# Altium project NRF_USB.PrjPcb
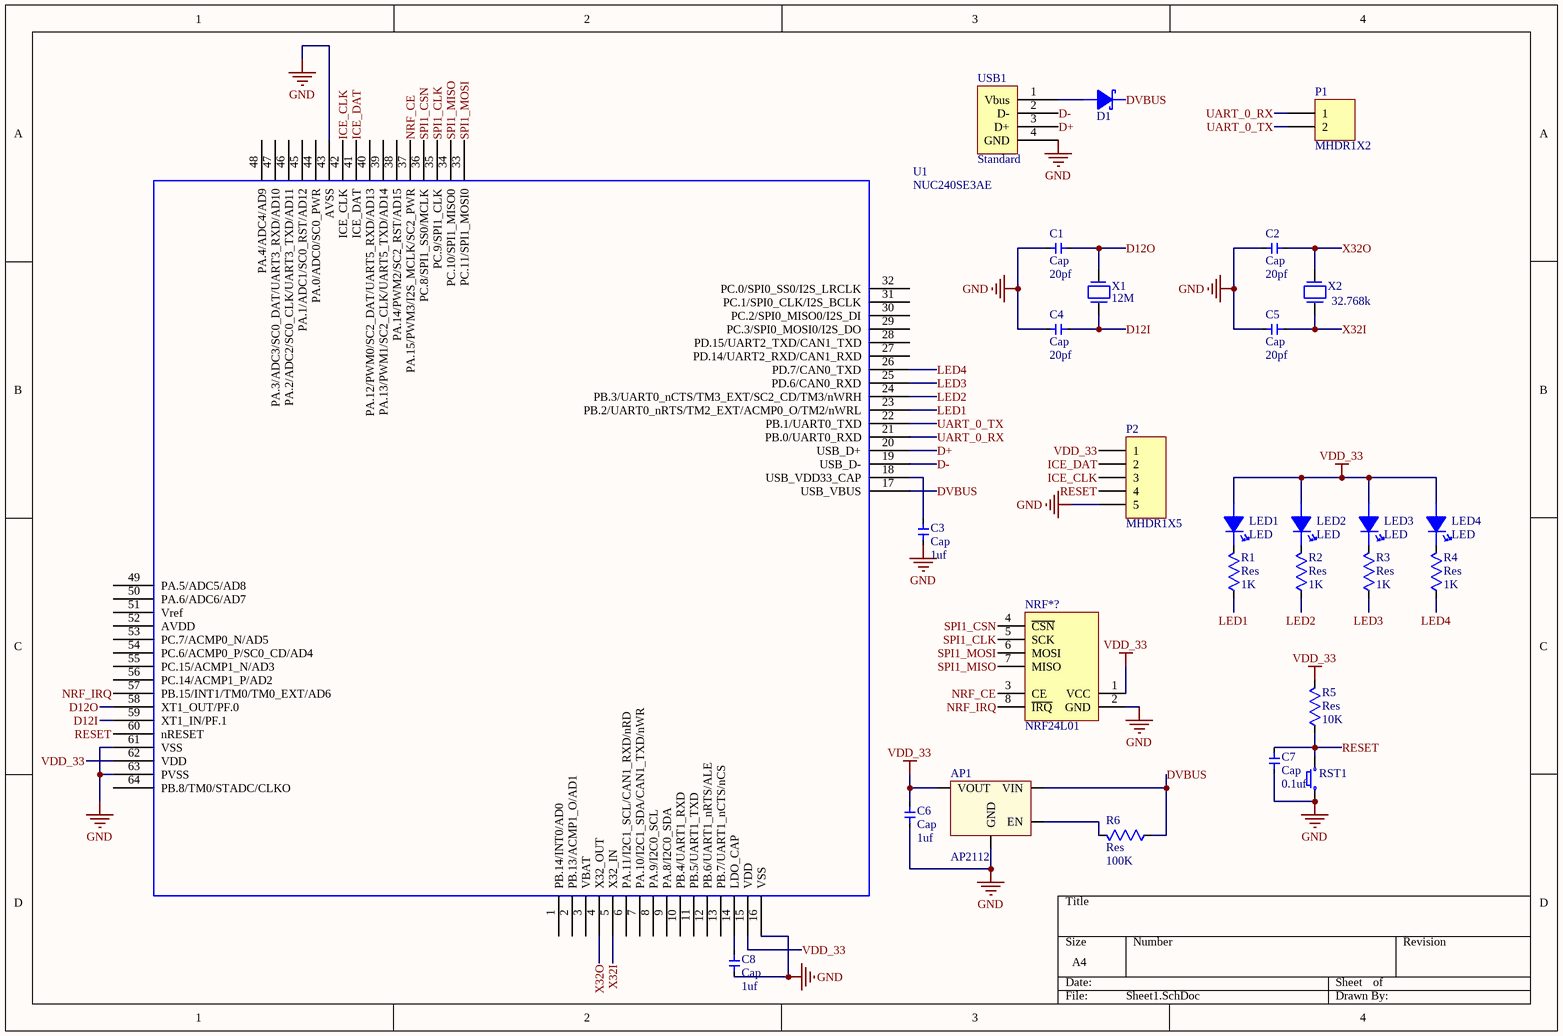
[diagram p0: Sheet1.SchDoc]
1 sheet, 28 parts. Net scope: global (net labels, ports and power ports of the same name join across sheets).
Board file: USB_NRF.PcbDoc

## Sheet Sheet1.SchDoc
size A4

### Parts
AP1  AP2112  [SOT-23-5]
C1  Cap  value 20pf  [Cap_0603]
C2  Cap  value 20pf  [Cap_0603]
C3  Cap  value 1uf  [Cap_0603]
C4  Cap  value 20pf  [Cap_0603]
C5  Cap  value 20pf  [Cap_0603]
C6  Cap  value 1uf  [Cap_0603]
C7  Cap  value 0.1uf  [Cap_0603]
C8  Cap  value 1uf  [Cap_0603]
D1  Schottky  [SOD-523]  (value not drawn)
LED1  LED  [SMD-0603_LED]
LED2  LED  [SMD-0603_LED]
LED3  LED  [SMD-0603_LED]
LED4  LED  [SMD-0603_LED]
NRF*?  NRF24L01  [NRF24L01_Module_SMD]
P1  MHDR1X2  [MHDR1X2]
P2  MHDR1X5  [MHDR1X5]
R1  Res  value 1K  [RES_0603]
R2  Res  value 1K  [RES_0603]
R3  Res  value 1K  [RES_0603]
R4  Res  value 1K  [RES_0603]
R5  Res  value 10K  [RES_0603]
R6  Res  value 100K  [RES_0603]
RST1  SPST  [TACK-SW_SMD 2P 4x3mm_2]  (value not drawn)
U1  NUC240SE3AE  [MCU_LQFP_64_7x7]
USB1  Standard  [USB_Type-A_P_Thru-Hole]
X1  value 12M  [2520S]  (hidden comment: Xtal)
X2  value 32.768k  [FC-135]  (hidden comment: Xtal)

### Nets
GND: AP1.2(GND) C1.1 C2.1 C3.2 C4.1 C5.1 C6.1 C7.1 C8.1 NRF*?.2(GND) P2.5 RST1.2 U1.16(VSS) U1.43(AVSS) U1.61(VSS) U1.63(PVSS) USB1.4(GND)
VDD_33: AP1.5(VOUT) C6.2 LED1.1 LED2.1 LED3.1 LED4.1 NRF*?.1(VCC) P2.1 R5.1 U1.15(VDD) U1.62(VDD)
D12I: C4.2 U1.59(XT1_IN/PF.1) X1.2
D12O: C1.2 U1.58(XT1_OUT/PF.0) X1.1
D+: U1.20(USB_D+) USB1.3(D+)
D-: U1.19(USB_D-) USB1.2(D-)
DVBUS: AP1.1(VIN) D1.2 R6.2 U1.17(USB_VBUS)
ICE_CLK: P2.3 U1.42(ICE_CLK)
ICE_DAT: P2.2 U1.41(ICE_DAT)
LED1: R1.2 U1.23(PB.2/UART0_nRTS/TM2_EXT/ACMP0_O/TM2/nWRL)
LED2: R2.2 U1.24(PB.3/UART0_nCTS/TM3_EXT/SC2_CD/TM3/nWRH)
LED3: R3.2 U1.25(PD.6/CAN0_RXD)
LED4: R4.2 U1.26(PD.7/CAN0_TXD)
NRF_CE: NRF*?.3(CE) U1.37(PA.15/PWM3/I2S_MCLK/SC2_PWR)
NRF_IRQ: NRF*?.8(~{IRQ}) U1.57(PB.15/INT1/TM0/TM0_EXT/AD6)
RESET: C7.2 P2.4 R5.2 RST1.1 U1.60(nRESET)
SPI1_CLK: NRF*?.5(SCK) U1.35(PC.9/SPI1_CLK)
SPI1_CSN: NRF*?.4(~{CSN}) U1.36(PC.8/SPI1_SS0/MCLK)
SPI1_MISO: NRF*?.7(MISO) U1.34(PC.10/SPI1_MISO0)
SPI1_MOSI: NRF*?.6(MOSI) U1.33(PC.11/SPI1_MOSI0)
UART_0_RX: P1.1 U1.21(PB.0/UART0_RXD)
UART_0_TX: P1.2 U1.22(PB.1/UART0_TXD)
X32I: C5.2 U1.5(X32_IN) X2.2
X32O: C2.2 U1.4(X32_OUT) X2.1
NetAP1_3: AP1.3(EN) R6.1
NetC3_1: C3.1 U1.18(USB_VDD33_CAP)
NetC8_2: C8.2 U1.14(LDO_CAP)
NetD1_1: D1.1 USB1.1(Vbus)
NetLED1_2: LED1.2 R1.1
NetLED2_2: LED2.2 R2.1
NetLED3_2: LED3.2 R3.1
NetLED4_2: LED4.2 R4.1

Not connected (* = marked no-connect by the designer): U1 1(PB.14/INT0/AD0) 2(PB.13/ACMP1_O/AD1) 3(VBAT) 6(PA.11/I2C1_SCL/CAN1_RXD/nRD) 7(PA.10/I2C1_SDA/CAN1_TXD/nWR) 8(PA.9/I2C0_SCL) 9(PA.8/I2C0_SDA) 10(PB.4/UART1_RXD) 11(PB.5/UART1_TXD) 12(PB.6/UART1_nRTS/ALE) 13(PB.7/UART1_nCTS/nCS) 27(PD.14/UART2_RXD/CAN1_RXD) 28(PD.15/UART2_TXD/CAN1_TXD) 29(PC.3/SPI0_MOSI0/I2S_DO) 30(PC.2/SPI0_MISO0/I2S_DI) 31(PC.1/SPI0_CLK/I2S_BCLK) 32(PC.0/SPI0_SS0/I2S_LRCLK) 38(PA.14/PWM2/SC2_RST/AD15) 39(PA.13/PWM1/SC2_CLK/UART5_TXD/AD14) 40(PA.12/PWM0/SC2_DAT/UART5_RXD/AD13) 44(PA.0/ADC0/SC0_PWR) 45(PA.1/ADC1/SC0_RST/AD12) 46(PA.2/ADC2/SC0_CLK/UART3_TXD/AD11) 47(PA.3/ADC3/SC0_DAT/UART3_RXD/AD10) 48(PA.4/ADC4/AD9) 49(PA.5/ADC5/AD8) 50(PA.6/ADC6/AD7) 51(Vref) 52(AVDD) 53(PC.7/ACMP0_N/AD5) 54(PC.6/ACMP0_P/SC0_CD/AD4) 55(PC.15/ACMP1_N/AD3) 56(PC.14/ACMP1_P/AD2) 64(PB.8/TM0/STADC/CLKO)

### Library data of the parts
D1 = Diode2
NRF*? = NRF24L01_module
P1 = MHDR1X2: Header, 2-Pin; LatestRevisionDate: 17-Jul-2002; LatestRevisionNote: Re-released for DXP Platform.; Publisher: Altium Limited
P2 = MHDR1X5: Header, 5-Pin; LatestRevisionDate: 17-Jul-2002; LatestRevisionNote: Re-released for DXP Platform.; Publisher: Altium Limited
RST1 = Switch_Button1
U1 = NUC240SE3AE: OriginalSymbolOrigin: (0,0)
USB1 = USB1